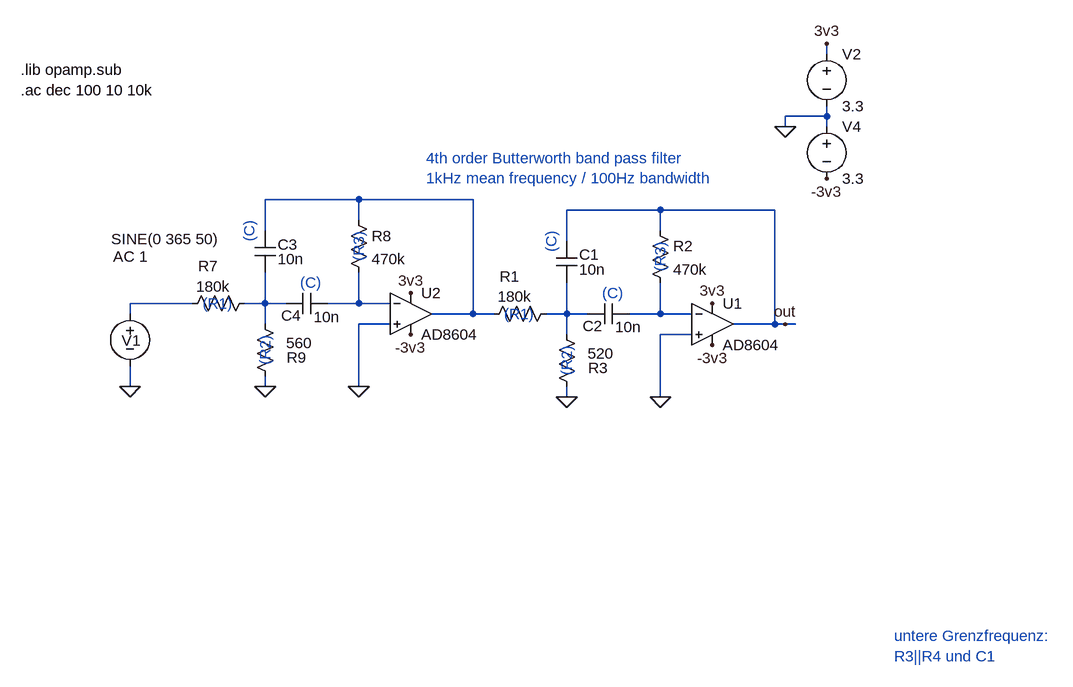
[diagram p0: schematic _mcL1_ButterBP_4thOrder.asc]
_mcL1_ButterBP_4thOrder.asc, the LTspice schematic file:
Version 4
SHEET 1 2304 1044
WIRE 1520 -208 1520 -224
WIRE 1520 -112 1520 -128
WIRE 1520 -112 1456 -112
WIRE 1456 -96 1456 -112
WIRE 1520 -96 1520 -112
WIRE 800 16 656 16
WIRE 976 16 800 16
WIRE 1264 32 1120 32
WIRE 1440 32 1264 32
WIRE 800 48 800 16
WIRE 656 64 656 16
WIRE 1264 64 1264 32
WIRE 1120 80 1120 32
WIRE 544 176 448 176
WIRE 656 176 656 128
WIRE 656 176 624 176
WIRE 688 176 656 176
WIRE 800 176 800 128
WIRE 800 176 752 176
WIRE 848 176 800 176
WIRE 448 192 448 176
WIRE 976 192 976 16
WIRE 976 192 912 192
WIRE 1008 192 976 192
WIRE 1120 192 1120 144
WIRE 1120 192 1088 192
WIRE 1152 192 1120 192
WIRE 1264 192 1264 144
WIRE 1264 192 1216 192
WIRE 1312 192 1264 192
WIRE 656 208 656 176
WIRE 848 208 800 208
WIRE 1440 208 1440 32
WIRE 1440 208 1376 208
WIRE 1456 208 1440 208
WIRE 1472 208 1456 208
WIRE 1120 224 1120 192
WIRE 1312 224 1264 224
WIRE 448 304 448 272
WIRE 656 304 656 288
WIRE 800 304 800 208
WIRE 1120 320 1120 304
WIRE 1264 320 1264 224
FLAG 1520 -224 3v3
FLAG 656 304 0
FLAG 800 304 0
FLAG 1456 -96 0
FLAG 1520 -16 -3v3
FLAG 880 160 3v3
FLAG 880 224 -3v3
FLAG 448 304 0
FLAG 1120 320 0
FLAG 1264 320 0
FLAG 1344 176 3v3
FLAG 1344 240 -3v3
FLAG 1456 208 out
SYMBOL voltage 448 176 R0
WINDOW 123 -26 -72 Left 2
WINDOW 39 0 0 Left 0
WINDOW 0 -13 57 Left 2
WINDOW 3 -29 -99 Left 2
SYMATTR Value2 AC 1
SYMATTR InstName V1
SYMATTR Value SINE(0 365 50)
SYMBOL voltage 1520 -224 R0
WINDOW 123 0 0 Left 0
WINDOW 39 0 0 Left 0
SYMATTR InstName V2
SYMATTR Value 3.3
SYMBOL res 528 192 R270
WINDOW 0 58 40 VTop 2
WINDOW 3 58 48 VBottom 2
SYMATTR InstName R7
SYMATTR Value 180k
SYMBOL res 784 32 R0
SYMATTR InstName R8
SYMATTR Value 470k
SYMBOL res 640 192 R0
WINDOW 0 49 67 Left 2
WINDOW 3 48 45 Left 2
SYMATTR InstName R9
SYMATTR Value 560
SYMBOL cap 640 64 R0
WINDOW 0 35 21 Left 2
WINDOW 3 35 44 Left 2
SYMATTR InstName C3
SYMATTR Value 10n
SYMBOL cap 752 160 R90
WINDOW 0 50 56 VBottom 2
WINDOW 3 21 1 VTop 2
SYMATTR InstName C4
SYMATTR Value 10n
SYMBOL voltage 1520 -112 R0
WINDOW 123 0 0 Left 0
WINDOW 39 0 0 Left 0
SYMATTR InstName V4
SYMATTR Value 3.3
SYMBOL Opamps\\AD8604 880 128 R0
SYMATTR InstName U2
SYMBOL res 992 208 R270
WINDOW 0 58 40 VTop 2
WINDOW 3 58 48 VBottom 2
SYMATTR InstName R1
SYMATTR Value 180k
SYMBOL res 1248 48 R0
SYMATTR InstName R2
SYMATTR Value 470k
SYMBOL res 1104 208 R0
WINDOW 0 49 67 Left 2
WINDOW 3 48 45 Left 2
SYMATTR InstName R3
SYMATTR Value 520
SYMBOL cap 1104 80 R0
WINDOW 0 35 21 Left 2
WINDOW 3 35 44 Left 2
SYMATTR InstName C1
SYMATTR Value 10n
SYMBOL cap 1216 176 R90
WINDOW 0 50 56 VBottom 2
WINDOW 3 21 1 VTop 2
SYMATTR InstName C2
SYMATTR Value 10n
SYMBOL Opamps\\AD8604 1344 144 R0
SYMATTR InstName U1
TEXT 280 -184 Left 2 !.lib opamp.sub
TEXT 1624 688 Left 2 ;untere Grenzfrequenz:\nR3||R4 und C1
TEXT 560 176 Left 2 ;(R1)
TEXT 656 224 VRight 2 ;(R2)
TEXT 800 64 VRight 2 ;(R3)
TEXT 632 48 VRight 2 ;(C)
TEXT 744 144 Right 2 ;(C)
TEXT 280 -152 Left 2 !.ac dec 100 10 10k
TEXT 904 -48 Left 2 ;4th order Butterworth band pass filter\n1kHz mean frequency / 100Hz bandwidth
TEXT 1024 192 Left 2 ;(R1)
TEXT 1120 240 VRight 2 ;(R2)
TEXT 1264 80 VRight 2 ;(R3)
TEXT 1096 64 VRight 2 ;(C)
TEXT 1208 160 Right 2 ;(C)

The netlist it stands for:
* _mcL1_ButterBP_4thOrder.asc
V1 N002 0 SINE(0 365 50) AC 1
V2 3v3 0 3.3
R7 N002 N003 180k
R8 N001 N004 470k
R9 N003 0 560
C3 N001 N003 10n
C4 N004 N003 10n
V4 0 -3v3 3.3
XU2 0 N004 3v3 -3v3 N001 AD8604  ; pins In+ In- V+ V- OUT
R1 N001 N005 180k
R2 out N006 470k
R3 N005 0 520
C1 out N005 10n
C2 N006 N005 10n
XU1 0 N006 3v3 -3v3 out AD8604  ; pins In+ In- V+ V- OUT
.lib opamp.sub
* untere Grenzfrequenz:
* R3||R4 und C1
* (R1)
* (R2)
* (R3)
* (C)
* (C)
.ac dec 100 10 10k
* 4th order Butterworth band pass filter
* 1kHz mean frequency / 100Hz bandwidth
* (R1)
* (R2)
* (R3)
* (C)
* (C)
.backanno
.end